# EAGLE design starter (EAGLE 9.5.2)
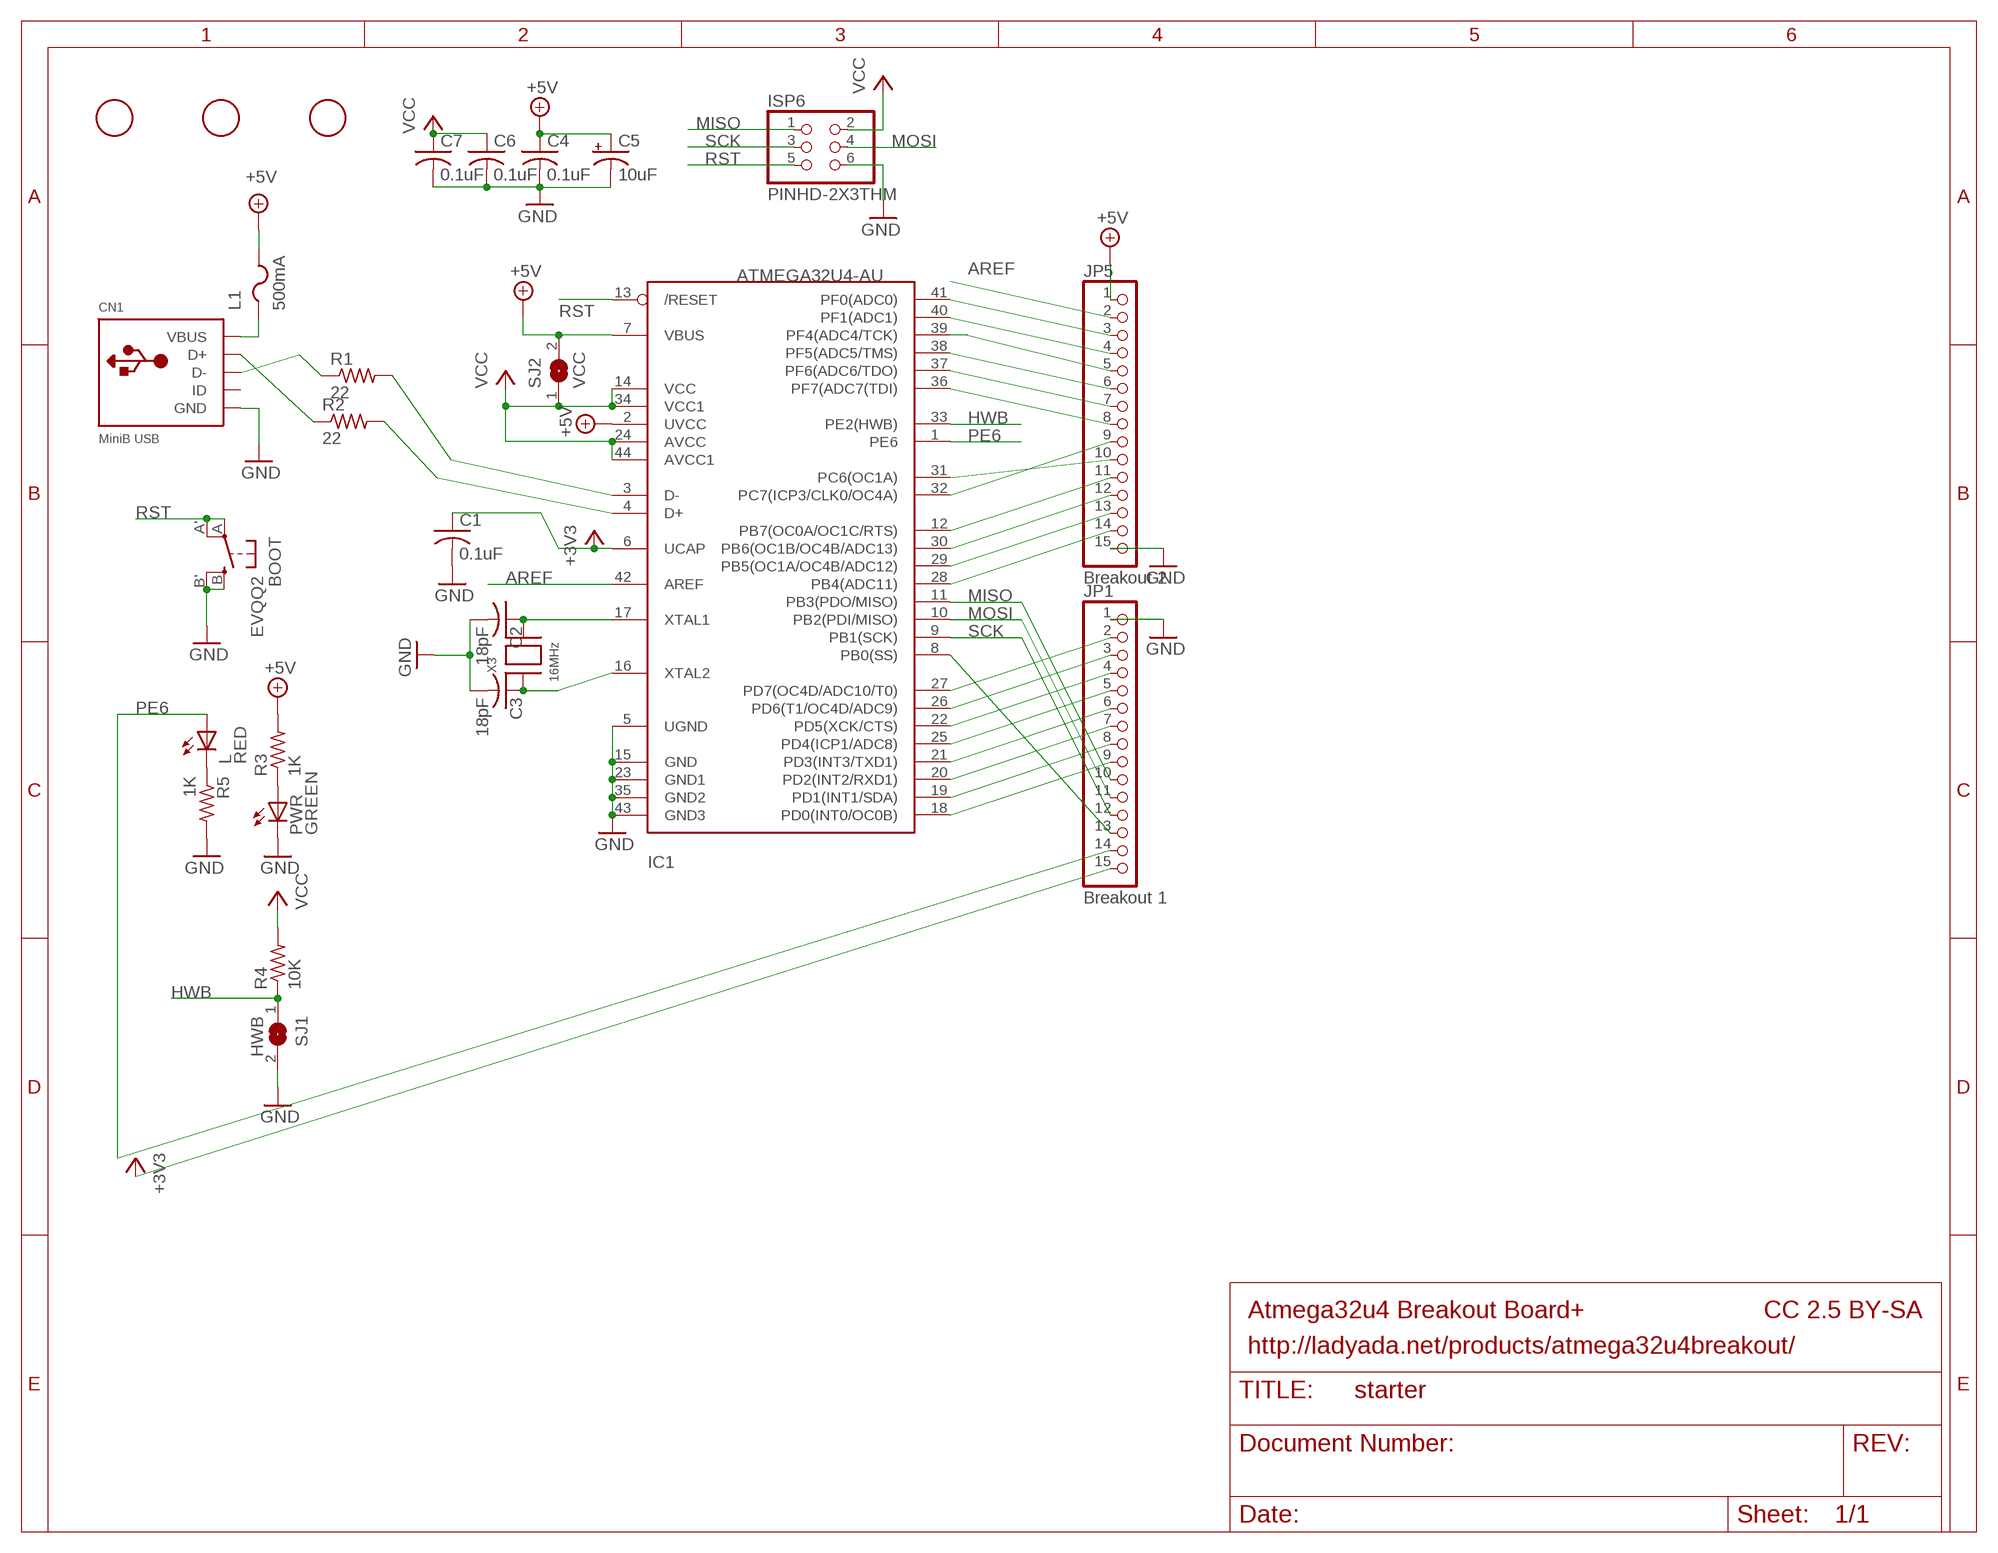
[diagram p0: schematic, sheet 1]

## Parts
BOOT  EVQQ2  [EVQ-Q2]
C1  0.1uF  C-USC0805K  [C0805K]
C2  18pF  C-USC0805K  [C0805K]
C3  18pF  C-USC0805K  [C0805K]
C4  0.1uF  C-USC0805K  [C0805K]
C5  10uF  CPOL-USA/3216-18R  [A/3216-18R]
C6  0.1uF  C-USC0805K  [C0805K]
C7  0.1uF  C-USC0805K  [C0805K]
CN1  MiniB USB  USBMINIB  [USB-MINIB]
IC1  ATMEGA32U4-AU  [TQFP44]
ISP6  PINHD-2X3THM  [ISP6]
JP1  Breakout 1  PINHD-1X15-CB  [1X15-CB]
JP5  Breakout 2  PINHD-1X15-CB  [1X15-CB]
L  RED  LEDCHIPLED_0805  [CHIPLED_0805]
L1  500mA  PTCFUSE-1206  [R1206]
PWR  GREEN  LEDCHIPLED_0805  [CHIPLED_0805]
R1  22  R-US_R0805  [R0805]
R2  22  R-US_R0805  [R0805]
R3  1K  R-US_R0805  [R0805]
R4  10K  R-US_R0805  [R0805]
R5  1K  R-US_R0805  [R0805]
SJ1  HWB  SJ  [SJ]
SJ2  VCC  SJ  [SJ]
U$1  FIDUCIAL  [FIDUCIAL_1MM]
U$2  FIDUCIAL  [FIDUCIAL_1MM]
U$6  FIDUCIAL  [FIDUCIAL_1MM]
X3  16MHz  XTALNX5032  [NX5032]

## Nets
+3V3: C1.1 IC1.6(UCAP) JP1.15
+5V: C4.1 C5.+ IC1.2(UVCC) IC1.7(VBUS) JP5.1 L1.2 R3.2 SJ2.2
AREF: IC1.42(AREF) JP5.2
GND: BOOT.B'(S1) BOOT.B(S) C1.2 C2.2 C3.2 C4.2 C5.- C6.2 C7.2 CN1.GND IC1.5(UGND) IC1.15(GND) IC1.23(GND1) IC1.35(GND2) IC1.43(GND3) ISP6.6 JP1.1 JP5.15 PWR.C R5.2 SJ1.2
HWB: IC1.33(PE2(HWB)) R4.1 SJ1.1
MISO: IC1.11(PB3(PDO/MISO)) ISP6.1 JP1.10
MOSI: IC1.10(PB2(PDI/MISO)) ISP6.4 JP1.11
N$1: PWR.A R3.1
N$2: CN1.D+ R2.1
N$3: IC1.3(D-) R1.2
N$4: IC1.4(D+) R2.2
N$5: CN1.D- R1.1
N$8: C2.1 IC1.17(XTAL1) X3.P$2
N$9: C3.1 IC1.16(XTAL2) X3.P$1
N$10: L.C R5.1
PB0: IC1.8(PB0(SS)) JP1.13
PB4: IC1.28(PB4(ADC11)) JP5.14
PB5: IC1.29(PB5(OC1A/OC4B/ADC12)) JP5.13
PB6: IC1.30(PB6(OC1B/OC4B/ADC13)) JP5.12
PB7: IC1.12(PB7(OC0A/OC1C/RTS)) JP5.11
PC6: IC1.31(PC6(OC1A)) JP5.10
PC7: IC1.32(PC7(ICP3/CLK0/OC4A)) JP5.9
PD0: IC1.18(PD0(INT0/OC0B)) JP1.9
PD1: IC1.19(PD1(INT1/SDA)) JP1.8
PD2: IC1.20(PD2(INT2/RXD1)) JP1.7
PD3: IC1.21(PD3(INT3/TXD1)) JP1.6
PD4: IC1.25(PD4(ICP1/ADC8)) JP1.5
PD5: IC1.22(PD5(XCK/CTS)) JP1.4
PD6: IC1.26(PD6(T1/OC4D/ADC9)) JP1.3
PD7: IC1.27(PD7(OC4D/ADC10/T0)) JP1.2
PE6: IC1.1(PE6) JP1.14 L.A
PF0: IC1.41(PF0(ADC0)) JP5.3
PF1: IC1.40(PF1(ADC1)) JP5.4
PF4: IC1.39(PF4(ADC4/TCK)) JP5.5
PF5: IC1.38(PF5(ADC5/TMS)) JP5.6
PF6: IC1.37(PF6(ADC6/TDO)) JP5.7
PF7: IC1.36(PF7(ADC7(TDI)) JP5.8
RST: BOOT.A'(P1) BOOT.A(P) IC1.13(/RESET) ISP6.5
SCK: IC1.9(PB1(SCK)) ISP6.3 JP1.12
VBUS: CN1.VBUS L1.1
VCC: C6.1 C7.1 IC1.14(VCC) IC1.24(AVCC) IC1.34(VCC1) IC1.44(AVCC1) ISP6.2 R4.2 SJ2.1
Unconnected: CN1.ID

## Notes on the sheet
- Atmega32u4 Breakout Board+ | CC 2.5 BY-SA
- http://ladyada.net/products/atmega32u4breakout/

## Library data of the parts
BOOT = adaprog:EVQQ2
C1-C4 C6 C7 = adafruit:C-US: CAPACITOR, American symbol
C5 = adafruit:CPOL-US: POLARIZED CAPACITOR, American symbol
CN1 = adafruit:USB: USB Connectors USBMINIB - Surface Mount Female Mini-B USB Connector 4UConnector: 06564 By microbuilder.eu Thru-hole RA Female Mini-B USB Connector 4UConnector: 18732 By ladyada.net
IC1 = adaprog:ATMEGA32U4
ISP6 = adaprog:PINHD-2X3
JP1 JP5 = adafruit:PINHD-1X15: PIN HEADER
L PWR = adafruit:LED: LED OSRAM: - CHIPLED LG R971, LG N971, LY N971, LG Q971, LY Q971, LO R971, LY R971 LH N974, LH R974 LS Q976, LO Q976, LY Q976 LO Q996 - Hyper CHIPLED LW Q18S LB Q993, LB Q99A, LB R99A - SideLED LS A670, LO A670, LY A670, LG A670, LP A670 LB A673, LV A673, LT A673, LW A673 LH A674 LY A675 LS A676, LA A676, LO A676, LY A676, LW A676 LS A679, LY A679, LG A679 - Hyper Micro SIDELED® LS Y876, LA Y876, LO Y876, LY Y876 LT Y87S - SmartLED LW L88C, LW L88S LB L89C, LB L89S, LG L890 LS L89K, LO L89K, LY L89K LS L896, LA L896, LO L896, LY L896 - TOPLED LS T670, LO T670, LY T670, LG T670, LP T670 LSG T670, LSP T670, LSY T670, LOP T670, LYG T670 LG T671, LOG T671, LSG T671 LB T673, LV T673, LT T673, LW T673 LH T674 LS T676, LA T676, LO T676, LY T676, LB T676, LH T676, LSB T676, LW T676 LB T67C, LV T67C, LT T67C, LS T67K, LO T67K, LY T67K, LW E67C LS E67B, LA E67B, LO E67B, LY E67B, LB E67C, LV E67C, LT E67C LW T67C LS T679, LY T679, LG T679 LS T770, LO T770, LY T770, LG T770, LP T770 LB T773, LV T773, LT T773, LW T773 LH T774 LS E675, LA E675, LY E675, LS T675 LS T776, LA T776, LO T776, LY T776, LB T776 LHGB T686 LT T68C, LB T68C - Hyper Mini TOPLED® LB M676 - Mini TOPLED Santana® LG M470 LS M47K, LO M47K, LY M47K Source: http://www.osram.convergy.de/
L1 = adafruit:PTCFUSE: PTC fuses, resettable thermistors
R1-R5 = adafruit:R-US_: RESISTOR, American symbol
SJ1 SJ2 = jumper:SJ: SMD solder JUMPER
U$1 U$2 U$6 = adafruit:FIDUCIAL: For use by pick and place machines to calibrate the vision/machine, 1mm By microbuilder.eu
X3 = adaprog:XTAL

## Board
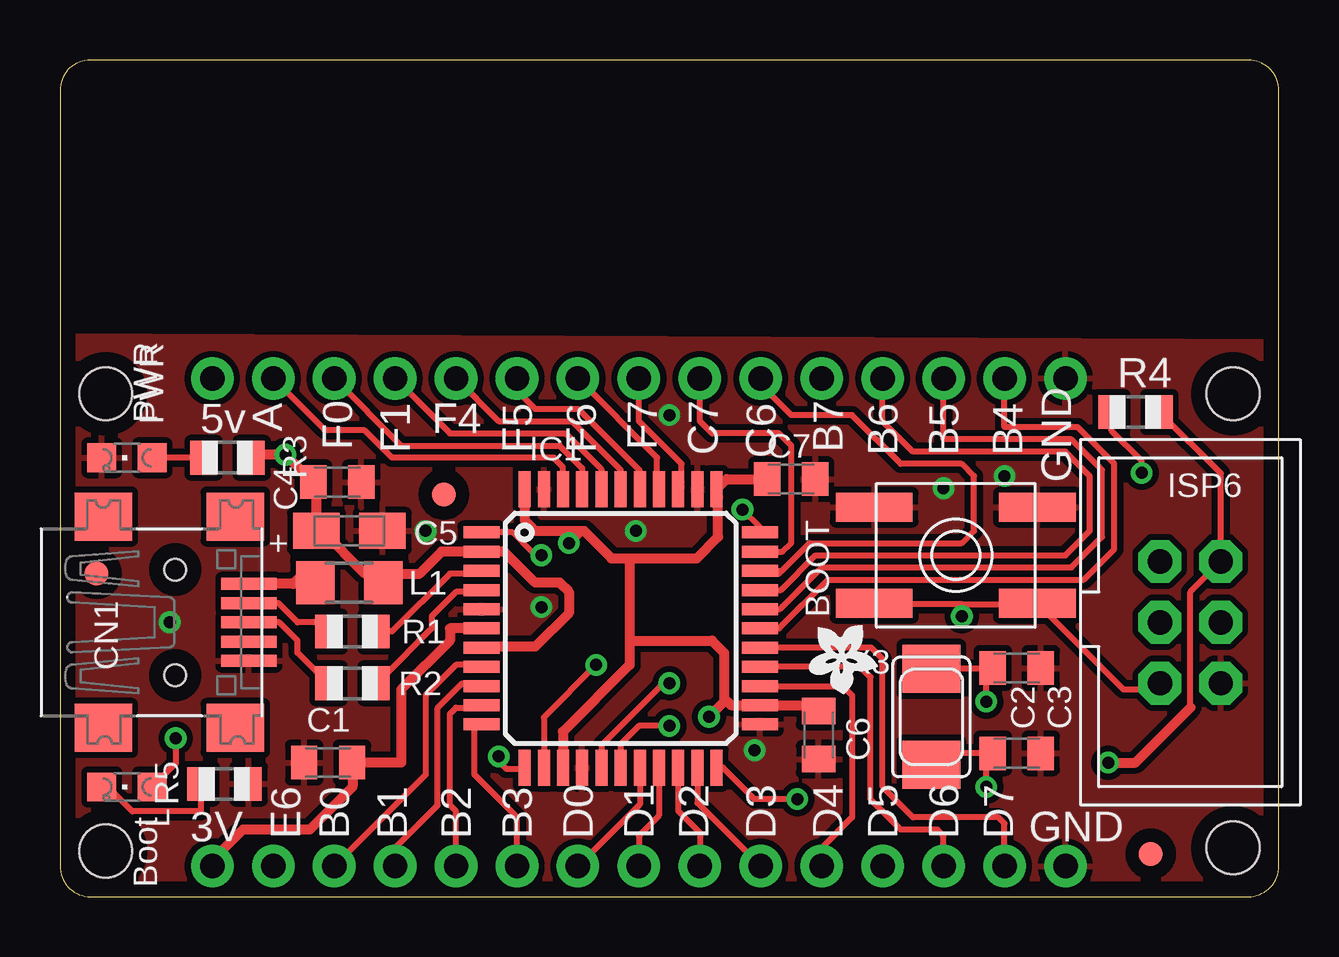
[diagram p1: board, top side]
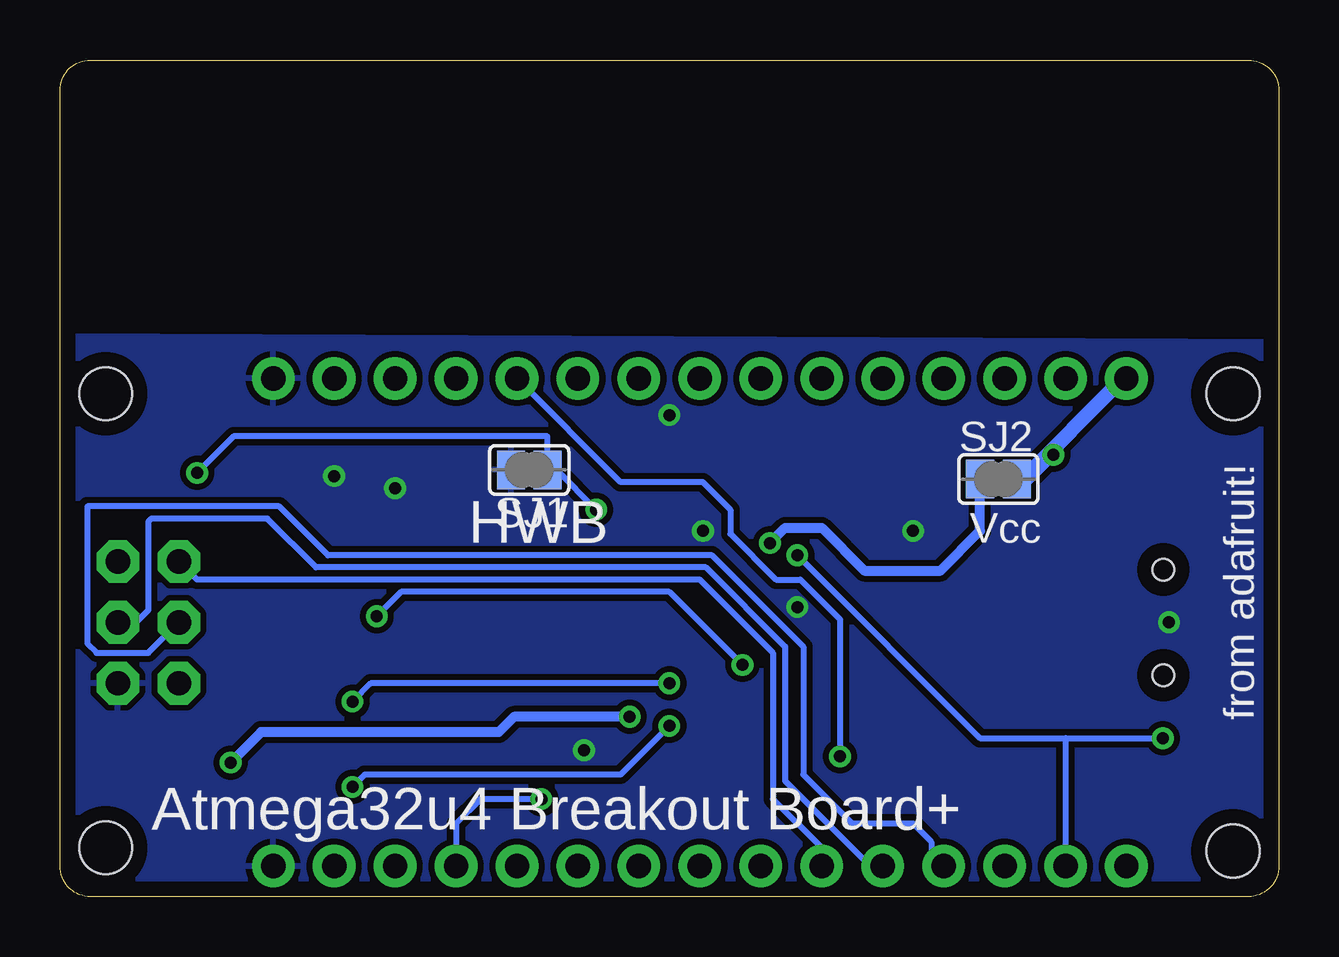
[diagram p2: board, bottom side, seen from below]

Size 50.8 x 34.86 mm. Coordinates in mm from the lower left corner, seen from the top.
Outline: 1.27,34.86 arc90 0,33.59 0,1.27 arc90 1.27,0 49.53,0 arc90 50.8,1.27 50.8,33.59 arc90 49.53,34.86 1.27,34.86
Copper layers (1*16): Top 0.035mm / dielectric 1.5mm / Bottom 0.035mm
Design rules "default *": minimum track width 10mil, minimum drill 19mil, track to track 10mil, track to pad 10mil, pad to pad 10mil, via to via 10mil, smd to smd 0mil, copper to edge 25mil, drill to drill 8mil, minimum pad ring 10mil, minimum via ring 8mil, stop-mask expansion 4mil, vias tented up to drill 20mil, thermal gap 10mil
Holes 2.2 mm at 1.9,20.95 1.9,1.9 48.89,20.95 48.89,2.03

### Footprints (pad centres in the part's own frame; a part is rotated, then mirrored left to right if it is on the bottom)
EVQ-Q2 = smd 3.2 x 1.2: A -3.4,-2; A' 3.4,-2; B -3.4,2; B' 3.4,2
C0805K = smd 1.1 x 1.4: 1 -1,0; 2 1,0
A/3216-18R = smd 1.95 x 1.5: + 1.375,0; - -1.375,0
USB-MINIB = smd 0.5 x 2.308: D+ 0,4.064; D- -0.8,4.064; GND 1.6,4.064; ID 0.8,4.064; VBUS -1.6,4.064 | smd 2 x 2.4: GND1 -4.4,-2; GND2 -4.4,3.5; GND3 4.4,3.5; GND4 4.4,-2 | hole 0.9: -2.2,1; 2.2,1
TQFP44 = smd 1.5 x 0.5: 1 -5.8,4; 2 -5.8,3.2; 3 -5.8,2.4; 4 -5.8,1.6; 5 -5.8,0.8; 6 -5.8,0; 7 -5.8,-0.8; 8 -5.8,-1.6; 9 -5.8,-2.4; 10 -5.8,-3.2; 11 -5.8,-4; 23 5.8,-4; 24 5.8,-3.2; 25 5.8,-2.4; 26 5.8,-1.6; 27 5.8,-0.8; 28 5.8,0; 29 5.8,0.8; 30 5.8,1.6; 31 5.8,2.4; 32 5.8,3.2; 33 5.8,4 | smd 0.5 x 1.5: 12 -4,-5.8; 13 -3.2,-5.8; 14 -2.4,-5.8; 15 -1.6,-5.8; 16 -0.8,-5.8; 17 0,-5.8; 18 0.8,-5.8; 19 1.6,-5.8; 20 2.4,-5.8; 21 3.2,-5.8; 22 4,-5.8; 34 4,5.8; 35 3.2,5.8; 36 2.4,5.8; 37 1.6,5.8; 38 0.8,5.8; 39 0,5.8; 40 -0.8,5.8; 41 -1.6,5.8; 42 -2.4,5.8; 43 -3.2,5.8; 44 -4,5.8
ISP6 = drill 1.016 pad 1.778 octagon: 1 -2.54,-1.27; 2 -2.54,1.27; 3 0,-1.27; 4 0,1.27; 5 2.54,-1.27; 6 2.54,1.27
1X15-CB = drill 1.016 pad 1.778: 1 -17.78,0; 2 -15.24,0; 3 -12.7,0; 4 -10.16,0; 5 -7.62,0; 6 -5.08,0; 7 -2.54,0; 8 0,0; 9 2.54,0; 10 5.08,0; 11 7.62,0; 12 10.16,0; 13 12.7,0; 14 15.24,0; 15 17.78,0
CHIPLED_0805 = smd 1.2 x 1.2: A 0,-1.05; C 0,1.05
R1206 = smd 1.6 x 1.803: 1 -1.422,0; 2 1.422,0
R0805 = smd 1.1 x 1.4: 1 -1,0; 2 1,0
SJ = smd 1.168 x 1.6: 1 -0.762,0; 2 0.762,0
FIDUCIAL_1MM = smd 1 x 1: 1 0,0
NX5032 = smd 2 x 2.4: P$1 2,0; P$2 -2,0

### Placement (x,y rotation side)
BOOT  37.34,14.22 0 top
C1  11.18,5.59 180 top
C2  39.88,5.97 0 top
C3  39.88,9.52 0 top
C4  11.56,17.27 0 top
C5  12.06,15.24 180 top
C6  31.62,6.73 270 top
C7  30.48,17.4 0 top
CN1  3.81,11.43 270 top
IC1  23.37,11.18 0 top
ISP6  47.12,11.43 270 top
JP1  24.13,1.27 180 top
JP5  24.13,21.59 0 top
L  2.79,4.57 90 top
L1  12.06,13.08 0 top
PWR  2.79,18.29 90 top
R1  12.19,11.05 0 top
R2  12.19,8.89 0 top
R3  6.99,18.29 0 top
R4  44.83,20.19 0 top
R5  6.86,4.7 0 top
SJ1  31.24,17.78 180 bottom
SJ2  11.68,17.4 0 bottom
U$1  45.47,1.78 0 top
U$2  1.52,13.46 0 top
U$4  [ADAFRUIT200MIL]  32.77,9.91 180 top
U$6  16,16.76 0 top
X3  36.32,7.49 90 top

### Tracks (layer width: path | path; a pad name or v marks a point on that pad's centre or on a via)
+3V3
  Top 0.254: 12.19,5.6 12.19,5.84 | 12.19,5.6 C1.1 12.19,5.59 12.19,5.6
  Top 0.406: IC1.6 16.26,11.18 16.26,10.67 14.22,8.64 14.22,5.59 12.19,5.59 12.19,4.57 10.41,2.79 7.62,2.79 6.35,1.52 JP1.15
  Bottom 0.406: JP1.15 6.22,1.27 6.22,1.14
+5V  (via drill 0.5)
  Top 0.254: 10.92,15.24 C5.+ | 13.49,13.44 13.46,13.46 12.7,13.46 | C4.1 10.56,17.13 10.69,17 | 17.53,10.41 IC1.7
  Top 0.406: 12.7,13.46 10.92,15.24 | L1.2 13.49,13.44 14.96,13.44 15.9,14.38 IC1.2 18.52,14.38 19.81,13.08 20.83,13.08 21.21,12.7 21.21,11.81 19.81,10.41 17.53,10.41 | C5.+ 10.69,17 | 10.56,17.26 10.67,17.14 10.67,17.65 | C4.1 10.56,17.26 | 10.56,17.26 v9.4,18.41 8.13,18.41 8,18.29 R3.2
  Bottom 0.61: JP5.1 6.48,21.59 10.79,17.27 | SJ2.2 10.92,17.27 10.79,17.27 | v9.4,18.41 9.53,18.41 10.67,17.27 10.79,17.27
AREF
  Top 0.254: IC1.42 20.97,17.89 20.57,18.29 13.84,18.29 12.7,19.43 11.05,19.43 JP5.2
GND  (via drill 0.5)
  Bottom 0.406: SJ1.2 30.86,17.78
  other vias: 20.07,12.07 4.57,11.43 15.24,15.24 24,15.24 28.96,6.1 25.4,20.07 36.83,17.02 39.37,17.53
  pour Top: -0.38,-0.51 -0.51,23.37 51.18,23.11 51.43,-0.89
  pour Bottom: -0.51,23.11 0.13,-0.51 50.93,-0.38 50.93,23.37
HWB  (via drill 0.5)
  Top 0.254: IC1.33 29.17,15.41 v28.45,16.13 | R4.1 43.83,19.41 45.09,18.16 v45.09,17.65
  Bottom 0.254: v28.45,16.13 30.1,17.78 SJ1.1 30.48,19.18 43.56,19.18 v45.09,17.65
MISO
  Top 0.254: JP1.10 19.05,3.3 17.27,5.08 17.27,7.11 17.53,7.11 17.53,7.13 IC1.11
  Bottom 0.254: ISP6.1 45.09,13.21 24.13,13.21 21.08,10.16 21.08,4.06 19.05,2.03 JP1.10
MOSI
  Top 0.254: JP1.11 16.51,3.56 16.26,3.81 16.26,7.62 16.51,7.87 17.53,7.87 17.53,7.93 IC1.10
  Bottom 0.254: JP1.11 17.02,1.27 20.57,4.83 20.57,10.41 23.88,13.72 40.13,13.72 42.16,15.75 46.99,15.75 47.12,15.62 47.12,11.94 47.62,11.43 ISP6.4
N$1
  Top 0.254: 6.08,18.29 R3.1 PWR.A
N$2
  Top 0.254: CN1.D+ 9.14,11.43 9.91,10.67 9.91,10.16 11.18,8.89 R2.1
N$3
  Top 0.254: R1.2 13.84,11.05 16.26,13.46 17.53,13.46 17.53,13.53 IC1.3
N$4
  Top 0.254: 13.46,9.14 15.49,11.18 15.49,11.68 16.51,12.7 17.53,12.7 17.53,12.73 IC1.4
  Top 0.406: R2.2 13.21,8.89 13.46,9.14
N$5
  Top 0.254: CN1.D- 9.11,12.23 9.91,11.43 10.92,11.43 | 11.43,10.92 11.45,10.94
  Top 0.406: R1.1 11.32,10.92 11.43,10.92 10.92,11.43
N$6
  Bottom 0.406: 11.05,17.4 12.32,17.4
N$8  (via drill 0.5)
  Top 0.254: v25.4,7.11 24.13,7.11 23.37,6.35 IC1.17 | X3.P$2 36.32,5.59 36.7,5.97 C2.1 38.88,5.86 38.61,5.59 v38.61,4.57
  Bottom 0.254: v25.4,7.11 27.43,5.08 38.1,5.08 v38.61,4.57
N$9  (via drill 0.5)
  Top 0.254: v25.4,8.89 25.15,8.89 22.57,6.31 IC1.16 | v38.61,8.13 38.61,9.14 38.88,9.41 C3.1 38.99,9.52 39.02,9.49 | 39.02,9.49 X3.P$1 | 39.02,9.49 39.12,9.4
  Bottom 0.254: v25.4,8.89 37.85,8.89 v38.61,8.13
N$10
  Top 0.254: R5.1 5.86,3.56 3.01,3.56 2,4.57 L.C
PB0
  Top 0.254: JP1.13 15.24,5.08 15.24,8.38 16.51,9.65 17.53,9.65 17.53,9.62 IC1.8
PB4
  Top 0.254: IC1.28 29.97,11.18 32,13.21 42.67,13.21 43.94,14.48 43.94,18.03 42.42,19.56 39.37,19.56 JP5.14
PB5
  Top 0.254: IC1.29 30.01,11.98 31.75,13.72 42.16,13.72 43.43,14.99 43.43,17.78 42.16,19.05 36.83,19.05 JP5.13
PB6
  Top 0.254: IC1.30 30.05,12.78 31.5,14.22 41.91,14.22 42.93,15.24 42.93,17.53 41.91,18.54 35.56,18.54 34.29,19.81 JP5.12
PB7  (via drill 0.5)
  Top 0.254: v18.29,5.84 18.29,5.63 18.58,5.33 19.33,5.33 IC1.12
  Bottom 0.254: JP5.11 27.43,17.27 24,17.27 22.86,16.13 22.86,15.11 20.95,13.21 19.94,13.21 18.29,11.56 v18.29,5.84
PC6
  Top 0.254: 29.97,13.46 29.21,13.46 29.1,13.58 IC1.31 30.09,13.58 31.24,14.73 37.59,14.73 38.1,15.24 38.1,17.53 37.59,18.03 35.05,18.03 33.02,20.07 30.48,20.07 29.21,21.34 JP5.10
PC7
  Top 0.254: IC1.32 30.12,14.38 30.48,14.73 30.48,18.8 29.97,19.3 27.18,19.3 26.67,19.81 JP5.9
PD0
  Top 0.254: IC1.18 24.17,3.85 JP1.9
PD1
  Top 0.254: JP1.8 24.13,2.54 24.97,3.38 IC1.19
PD2
  Top 0.254: IC1.20 25.77,3.57 26.67,2.67 JP1.7
PD3
  Top 0.254: IC1.21 26.57,3.91 JP1.6
PD4
  Top 0.254: IC1.25 32.63,8.78 33.02,8.38 33.02,3.3 31.75,2.03 JP1.5
PD5  (via drill 0.5)
  Top 0.254: IC1.22 27.64,5.38 28.96,4.06 v30.73,4.06
  Bottom 0.254: JP1.4 34.29,3.05 33.27,4.06 v30.73,4.06
PD6
  Top 0.254: IC1.26 33.35,9.58 33.78,9.14 33.78,4.06 35.05,2.79 36.58,2.79 36.83,2.54 JP1.3
PD7
  Top 0.254: IC1.27 33.82,10.38 34.29,9.91 34.29,4.57 35.56,3.3 39.12,3.3 39.37,3.05 JP1.2
PE6  (via drill 0.5)
  Top 0.254: L.A 4.83,5.55 v4.83,6.6 | v20.07,14.22 19.94,14.35 19.68,14.35 18.86,15.18 17.59,15.18 17.57,15.2 | 17.02,15.24 17.5,15.24 IC1.1 17.57,15.2 | 17.57,15.2 17.53,15.24
  Bottom 0.254: 8.89,6.6 12.45,6.6 v20.07,14.22 | 8.89,6.6 v4.83,6.6 | 8.89,6.6 JP1.14
PF0
  Top 0.254: IC1.41 21.77,17.86 20.83,18.8 14.22,18.8 JP5.3 11.18,21.84
PF1
  Top 0.254: IC1.40 22.57,17.82 21.08,19.3 16.26,19.3 JP5.4
PF4
  Top 0.254: IC1.39 23.37,17.78 21.34,19.81 18.29,19.81 JP5.5
PF5
  Top 0.254: IC1.38 24.17,17.74 21.59,20.32 19.81,20.32 18.8,21.34 JP5.6
PF6
  Top 0.254: JP5.7 24.89,18.29 24.89,17.02 24.93,17.02 IC1.37
PF7
  Top 0.254: JP5.8 24.13,19.81 25.91,18.03 25.91,17.27 | 25.91,17.12 25.91,17.02 25.81,17.02 IC1.36 25.91,17.12 | 25.91,17.12 25.91,17.27 | 25.91,17.27 25.87,17.23
RST  (via drill 0.5)
  Top 0.254: BOOT.A 33.97,12.19 37.59,12.19 | 37.59,12.19 40.71,12.19 BOOT.A' 44.33,8.64 45.72,8.64 45.72,8.76 ISP6.5 | v37.59,11.68 37.59,12.19 | IC1.13 20.17,7.47 v22.35,9.65
  Bottom 0.254: v22.35,9.65 25.4,12.7 36.58,12.7 v37.59,11.68
SCK
  Top 0.254: JP1.12 13.97,2.03 15.75,3.81 15.75,7.87 16.76,8.89 17.53,8.89 17.53,8.82 IC1.9
  Bottom 0.254: JP1.12 14.48,1.78 14.48,2.29 15.24,3.05 17.78,3.05 19.81,5.08 19.81,10.41 23.62,14.22 39.62,14.22 41.66,16.26 49.66,16.26 49.66,10.54 49.28,10.16 47.12,10.16 ISP6.3
VBUS
  Top 0.254: 10.64,13.49 10.41,13.72
  Top 0.406: L1.1 10.64,13.49 | CN1.VBUS 9.73,13.03 10.41,13.72
VCC  (via drill 0.5)
  Top 0.254: R4.2 48.39,17.64 ISP6.2 47.12,12.7 47.12,7.87
  Top 0.406: C7.1 27.79,17.4 IC1.34 27.37,16.7 27.43,16.64 27.43,14.99 26.54,14.1 23.75,14.1 | IC1.44 19.37,15.68 19.81,15.24 21.72,15.24 | 21.72,15.24 21.84,15.24 22.99,14.1 23.75,14.1 | IC1.14 20.97,6.87 23.75,9.65 23.75,10.67 | 23.75,14.1 23.75,10.67 | 27.69,8.25 27.96,7.98 IC1.24 31.27,7.98 31.62,7.62 C6.1 | 27.69,8.25 27.69,10.16 27.18,10.67 23.75,10.67 | v27.05,7.49 27.69,8.13 27.69,8.25 | 21.72,15.24 v21.21,14.73 | 47.12,7.87 44.83,5.59 v43.69,5.59
  Bottom 0.406: v43.69,5.59 42.42,6.86 32.51,6.86 31.88,7.49 v27.05,7.49 | SJ2.1 12.45,15.24 14.1,13.59 17.27,13.59 19.05,15.37 20.57,15.37 v21.21,14.73

### Text on the board
tPlace: 5v | A | F0 | F1 | F5 | F6 | F7 | C7 | C6 | B7 | B6 | B5 | B4 | PWR | F4 | GND | 3V | E6 | B0 | B1 | B2 | B3 | D0 | D1 | D2 | D3 | D4 | D5 | D6 | D7 | GND | Boot
bPlace: from adafruit! | Vcc | HWB | Atmega32u4 Breakout Board+